# Altium schematic sheet Peripherals - Servos.SchDoc
size 420 x 297 mm; SheetNumber: 6; SheetTotal: 6
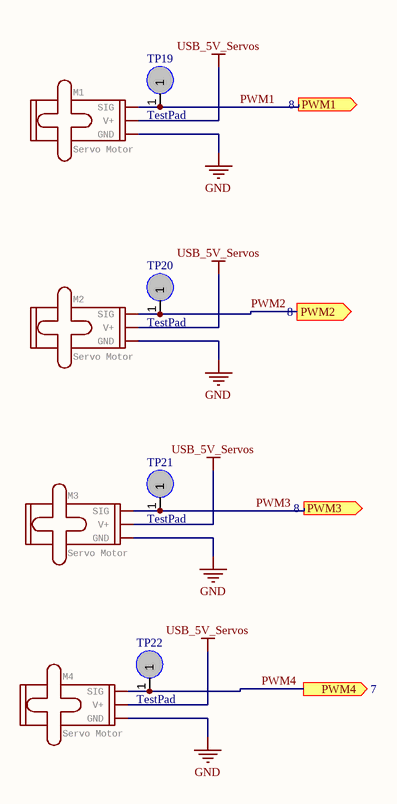
[diagram p0: Peripherals - Servos.SchDoc]

## Parts
M1  Servo Motor  [1X03]
M2  Servo Motor  [1X03]
M3  Servo Motor  [1X03]
M4  Servo Motor  [1X03]
TP19  TestPad  [TestPad50mil]
TP20  TestPad  [TestPad50mil]
TP21  TestPad  [TestPad50mil]
TP22  TestPad  [TestPad50mil]

## Ports
PWM1 (out, see 8), PWM2 (out, see 8), PWM3 (out, see 8), PWM4 (out, see 7)

## Nets
GND: M1.3(GND) M2.3(GND) M3.3(GND) M4.3(GND)
USB_5V_Servos: M1.2(V+) M2.2(V+) M3.2(V+) M4.2(V+)
PWM1: M1.1(SIG) TP19.1 ; port PWM1
PWM2: M2.1(SIG) TP20.1 ; port PWM2
PWM3: M3.1(SIG) TP21.1 ; port PWM3
PWM4: M4.1(SIG) TP22.1 ; port PWM4

## Notes on the sheet
- THIS DOCUMENT AND THE DATA DISCLOSED HEREIN OR
- HEREWITH IS THE PROPERTY OF ALTIUM LIMITED AND MAY
- DWG NO:
- REVISION
- REV:
- DESCRIPTION
- DATE
- APPROVED
- BE FREELY DISTRIBUTED IN WHOLE. NO RIGHTS ARE
- RESERVED OR EXPRESS OR IMPLIED WARANTEE GIVEN.
- ENG:
- APPROVALS
- PROJECT
- DSN:
- CHK:
- REFERENCE DOCUMENTS
- PROJECT REVISION:
- TITLE
- DOCUMENT REVISION:
- DESIGN ITEM:
- BOM:
- FAB DWG:
- PCB DWG:
- ASSY DWG:
- SCALE:
- A3
- SIZE
- CAGE CODE
- FILE NAME
- DWG NO.
- SHEET
- OF
- REV

## Library data of the parts
M1-M4 = SERVO: GateName_1: G$1; SymbolName_1: SMALL_SERVO_MOTOR; LibraryName: SparkFun-Electromechanical; DeviceSetName: SERVO; Package: 1X03